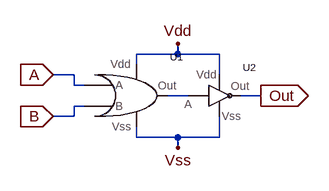
[diagram p0: schematic NOR1.asc]
NOR1.asc, the LTspice schematic file:
Version 4
SHEET 1 880 680
WIRE 288 96 288 80
WIRE 288 96 224 96
WIRE 352 96 288 96
WIRE 224 112 224 96
WIRE 128 128 96 128
WIRE 352 128 352 96
WIRE 128 144 128 128
WIRE 144 144 128 144
WIRE 304 160 272 160
WIRE 416 160 384 160
WIRE 144 176 128 176
WIRE 128 192 128 176
WIRE 128 192 96 192
WIRE 224 224 224 208
WIRE 288 224 224 224
WIRE 352 224 352 192
WIRE 352 224 288 224
WIRE 288 240 288 224
FLAG 96 128 A
IOPIN 96 128 In
FLAG 96 192 B
IOPIN 96 192 In
FLAG 416 160 Out
IOPIN 416 160 Out
FLAG 288 80 Vdd
FLAG 288 240 Vss
SYMBOL OR1 160 160 R0
SYMATTR InstName U1
SYMBOL NOT1 336 160 R0
SYMATTR InstName U2

The netlist it stands for:
* NOR1.asc
XU1 Vdd Vss N001 A B OR1  ; pins Vdd Vss Out A B
XU2 Vdd Vss N001 Out NOT1  ; pins Vdd Vss A Out
.lib OR1.sub
.lib NOT1.sub
.backanno
.end